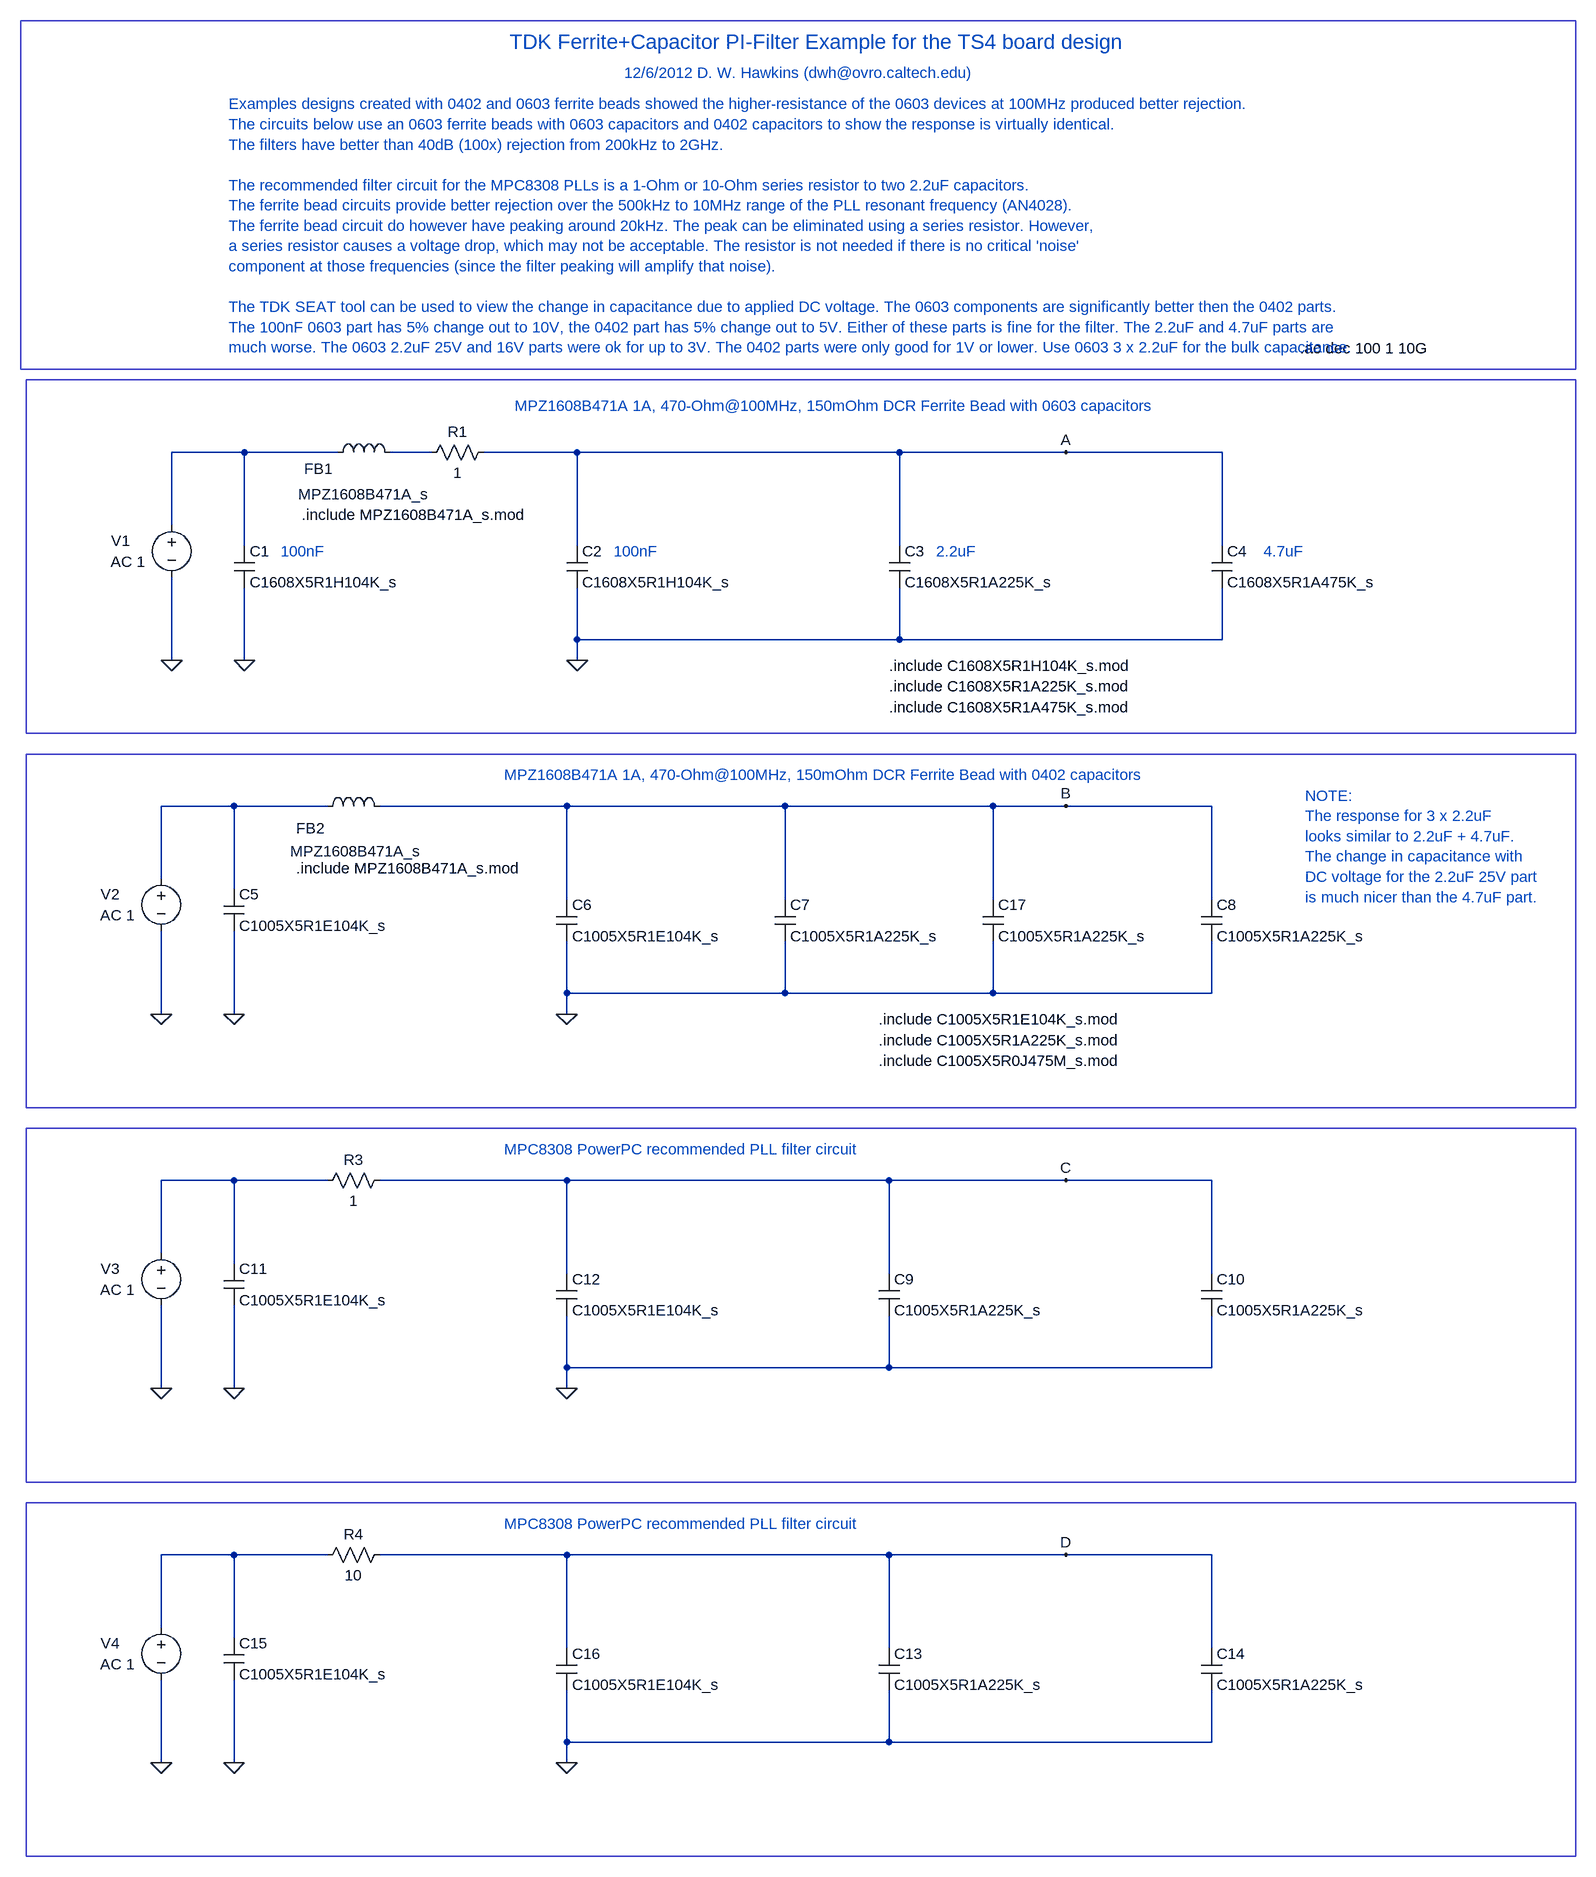
[diagram p0: schematic pi_filter_ts4_board.asc]
pi_filter_ts4_board.asc, the LTspice schematic file:
Version 4
SHEET 1 2924 2692
WIRE 304 -48 192 -48
WIRE 448 -48 304 -48
WIRE 592 -48 528 -48
WIRE 816 -48 672 -48
WIRE 1312 -48 816 -48
WIRE 1568 -48 1312 -48
WIRE 1808 -48 1568 -48
WIRE 192 64 192 -48
WIRE 304 96 304 -48
WIRE 816 96 816 -48
WIRE 1312 96 1312 -48
WIRE 1808 96 1808 -48
WIRE 816 240 816 160
WIRE 1312 240 1312 160
WIRE 1312 240 816 240
WIRE 1808 240 1808 160
WIRE 1808 240 1312 240
WIRE 192 272 192 144
WIRE 304 272 304 160
WIRE 816 272 816 240
WIRE 288 496 176 496
WIRE 432 496 288 496
WIRE 800 496 512 496
WIRE 1136 496 800 496
WIRE 1456 496 1136 496
WIRE 1568 496 1456 496
WIRE 1792 496 1568 496
WIRE 176 608 176 496
WIRE 288 624 288 496
WIRE 800 640 800 496
WIRE 1136 640 1136 496
WIRE 1456 640 1456 496
WIRE 1792 640 1792 496
WIRE 800 784 800 704
WIRE 1136 784 1136 704
WIRE 1136 784 800 784
WIRE 1456 784 1456 704
WIRE 1456 784 1136 784
WIRE 1792 784 1792 704
WIRE 1792 784 1456 784
WIRE 176 816 176 688
WIRE 288 816 288 688
WIRE 800 816 800 784
WIRE 288 1072 176 1072
WIRE 432 1072 288 1072
WIRE 800 1072 512 1072
WIRE 1296 1072 800 1072
WIRE 1568 1072 1296 1072
WIRE 1792 1072 1568 1072
WIRE 176 1184 176 1072
WIRE 288 1200 288 1072
WIRE 800 1216 800 1072
WIRE 1296 1216 1296 1072
WIRE 1792 1216 1792 1072
WIRE 800 1360 800 1280
WIRE 1296 1360 1296 1280
WIRE 1296 1360 800 1360
WIRE 1792 1360 1792 1280
WIRE 1792 1360 1296 1360
WIRE 176 1392 176 1264
WIRE 288 1392 288 1264
WIRE 800 1392 800 1360
WIRE 288 1648 176 1648
WIRE 432 1648 288 1648
WIRE 800 1648 512 1648
WIRE 1296 1648 800 1648
WIRE 1568 1648 1296 1648
WIRE 1792 1648 1568 1648
WIRE 176 1760 176 1648
WIRE 288 1776 288 1648
WIRE 800 1792 800 1648
WIRE 1296 1792 1296 1648
WIRE 1792 1792 1792 1648
WIRE 800 1936 800 1856
WIRE 1296 1936 1296 1856
WIRE 1296 1936 800 1936
WIRE 1792 1936 1792 1856
WIRE 1792 1936 1296 1936
WIRE 176 1968 176 1840
WIRE 288 1968 288 1840
WIRE 800 1968 800 1936
FLAG 192 272 0
FLAG 304 272 0
FLAG 816 272 0
FLAG 176 816 0
FLAG 288 816 0
FLAG 800 816 0
FLAG 1568 -48 A
FLAG 1568 496 B
FLAG 176 1392 0
FLAG 1568 1072 C
FLAG 288 1392 0
FLAG 800 1392 0
FLAG 176 1968 0
FLAG 1568 1648 D
FLAG 288 1968 0
FLAG 800 1968 0
SYMBOL ind 432 -32 R270
WINDOW 0 -25 -14 VTop 2
WINDOW 3 -33 56 VBottom 2
SYMATTR InstName FB1
SYMATTR Value MPZ1608B471A_s
SYMATTR Prefix X
SYMBOL cap 800 96 R0
SYMATTR InstName C2
SYMATTR Value C1608X5R1H104K_s
SYMATTR Prefix X
SYMBOL cap 1296 96 R0
SYMATTR InstName C3
SYMATTR Value C1608X5R1A225K_s
SYMATTR Prefix X
SYMBOL cap 1792 96 R0
SYMATTR InstName C4
SYMATTR Value C1608X5R1A475K_s
SYMATTR Prefix X
SYMBOL cap 288 96 R0
SYMATTR InstName C1
SYMATTR Value C1608X5R1H104K_s
SYMATTR Prefix X
SYMBOL voltage 192 48 R0
WINDOW 0 -93 40 Left 2
WINDOW 123 -94 72 Left 2
WINDOW 39 0 0 Left 2
SYMATTR InstName V1
SYMATTR Value2 AC 1
SYMATTR Value ""
SYMBOL ind 416 512 R270
WINDOW 0 -34 -10 VTop 2
WINDOW 3 -38 60 VBottom 2
SYMATTR InstName FB2
SYMATTR Value MPZ1608B471A_s
SYMATTR Prefix X
SYMBOL cap 784 640 R0
SYMATTR InstName C6
SYMATTR Value C1005X5R1E104K_s
SYMATTR Prefix X
SYMBOL cap 1120 640 R0
SYMATTR InstName C7
SYMATTR Value C1005X5R1A225K_s
SYMATTR Prefix X
SYMBOL cap 1776 640 R0
SYMATTR InstName C8
SYMATTR Value C1005X5R1A225K_s
SYMATTR Prefix X
SYMBOL cap 272 624 R0
SYMATTR InstName C5
SYMATTR Value C1005X5R1E104K_s
SYMATTR Prefix X
SYMBOL voltage 176 592 R0
WINDOW 0 -93 40 Left 2
WINDOW 123 -94 72 Left 2
WINDOW 39 0 0 Left 2
SYMATTR InstName V2
SYMATTR Value2 AC 1
SYMATTR Value ""
SYMBOL cap 1280 1216 R0
SYMATTR InstName C9
SYMATTR Value C1005X5R1A225K_s
SYMATTR Prefix X
SYMBOL cap 1776 1216 R0
SYMATTR InstName C10
SYMATTR Value C1005X5R1A225K_s
SYMATTR Prefix X
SYMBOL voltage 176 1168 R0
WINDOW 0 -93 40 Left 2
WINDOW 123 -94 72 Left 2
WINDOW 39 0 0 Left 2
SYMATTR InstName V3
SYMATTR Value2 AC 1
SYMATTR Value ""
SYMBOL res 416 1088 R270
WINDOW 0 32 56 VTop 2
WINDOW 3 0 56 VBottom 2
SYMATTR InstName R3
SYMATTR Value 1
SYMBOL cap 272 1200 R0
SYMATTR InstName C11
SYMATTR Value C1005X5R1E104K_s
SYMATTR Prefix X
SYMBOL cap 784 1216 R0
SYMATTR InstName C12
SYMATTR Value C1005X5R1E104K_s
SYMATTR Prefix X
SYMBOL cap 1280 1792 R0
SYMATTR InstName C13
SYMATTR Value C1005X5R1A225K_s
SYMATTR Prefix X
SYMBOL cap 1776 1792 R0
SYMATTR InstName C14
SYMATTR Value C1005X5R1A225K_s
SYMATTR Prefix X
SYMBOL voltage 176 1744 R0
WINDOW 0 -93 40 Left 2
WINDOW 123 -94 72 Left 2
WINDOW 39 0 0 Left 2
SYMATTR InstName V4
SYMATTR Value2 AC 1
SYMATTR Value ""
SYMBOL res 416 1664 R270
WINDOW 0 32 56 VTop 2
WINDOW 3 0 56 VBottom 2
SYMATTR InstName R4
SYMATTR Value 10
SYMBOL cap 272 1776 R0
SYMATTR InstName C15
SYMATTR Value C1005X5R1E104K_s
SYMATTR Prefix X
SYMBOL cap 784 1792 R0
SYMATTR InstName C16
SYMATTR Value C1005X5R1E104K_s
SYMATTR Prefix X
SYMBOL res 576 -32 R270
WINDOW 0 32 56 VTop 2
WINDOW 3 0 56 VBottom 2
SYMATTR InstName R1
SYMATTR Value 1
SYMBOL cap 1440 640 R0
SYMATTR InstName C17
SYMATTR Value C1005X5R1A225K_s
SYMATTR Prefix X
TEXT 1928 -208 Left 2 !.ac dec 100 1 10G
TEXT 720 -120 Left 2 ;MPZ1608B471A 1A, 470-Ohm@100MHz, 150mOhm DCR Ferrite Bead with 0603 capacitors
TEXT 704 448 Left 2 ;MPZ1608B471A 1A, 470-Ohm@100MHz, 150mOhm DCR Ferrite Bead with 0402 capacitors
TEXT 712 -680 Left 3 ;TDK Ferrite+Capacitor PI-Filter Example for the TS4 board design
TEXT 888 -632 Left 2 ;12/6/2012 D. W. Hawkins (dwh@ovro.caltech.edu)
TEXT 280 -584 Left 2 ;Examples designs created with 0402 and 0603 ferrite beads showed the higher-resistance of the 0603 devices at 100MHz produced better rejection. \nThe circuits below use an 0603 ferrite beads with 0603 capacitors and 0402 capacitors to show the response is virtually identical.\nThe filters have better than 40dB (100x) rejection from 200kHz to 2GHz.\n \nThe recommended filter circuit for the MPC8308 PLLs is a 1-Ohm or 10-Ohm series resistor to two 2.2uF capacitors.\nThe ferrite bead circuits provide better rejection over the 500kHz to 10MHz range of the PLL resonant frequency (AN4028).\nThe ferrite bead circuit do however have peaking around 20kHz. The peak can be eliminated using a series resistor. However, \na series resistor causes a voltage drop, which may not be acceptable. The resistor is not needed if there is no critical 'noise' \ncomponent at those frequencies (since the filter peaking will amplify that noise).\n \nThe TDK SEAT tool can be used to view the change in capacitance due to applied DC voltage. The 0603 components are significantly better then the 0402 parts.\nThe 100nF 0603 part has 5% change out to 10V, the 0402 part has 5% change out to 5V. Either of these parts is fine for the filter. The 2.2uF and 4.7uF parts are\nmuch worse. The 0603 2.2uF 25V and 16V parts were ok for up to 3V. The 0402 parts were only good for 1V or lower. Use 0603 3 x 2.2uF for the bulk capacitance.
TEXT 1296 344 Left 2 !.include C1608X5R1A475K_s.mod
TEXT 1296 312 Left 2 !.include C1608X5R1A225K_s.mod
TEXT 392 48 Left 2 !.include MPZ1608B471A_s.mod
TEXT 1296 280 Left 2 !.include C1608X5R1H104K_s.mod
TEXT 1368 104 Left 2 ;2.2uF
TEXT 1872 104 Left 2 ;4.7uF
TEXT 872 104 Left 2 ;100nF
TEXT 360 104 Left 2 ;100nF
TEXT 1280 888 Left 2 !.include C1005X5R0J475M_s.mod
TEXT 1280 856 Left 2 !.include C1005X5R1A225K_s.mod
TEXT 1280 824 Left 2 !.include C1005X5R1E104K_s.mod
TEXT 704 1024 Left 2 ;MPC8308 PowerPC recommended PLL filter circuit
TEXT 704 1600 Left 2 ;MPC8308 PowerPC recommended PLL filter circuit
TEXT 384 592 Left 2 !.include MPZ1608B471A_s.mod
TEXT 1936 480 Left 2 ;NOTE: \nThe response for 3 x 2.2uF\nlooks similar to 2.2uF + 4.7uF.\nThe change in capacitance with\nDC voltage for the 2.2uF 25V part\nis much nicer than the 4.7uF part.
RECTANGLE Normal 2352 384 -32 -160
RECTANGLE Normal 2352 -176 -40 -712
RECTANGLE Normal 2352 960 -32 416
RECTANGLE Normal 2352 1536 -32 992
RECTANGLE Normal 2352 2112 -32 1568

The netlist it stands for:
* pi_filter_ts4_board.asc
XFB1 N001 N002 MPZ1608B471A_s  ; pins A B
XC2 A 0 C1608X5R1H104K_s  ; pins A B
XC3 A 0 C1608X5R1A225K_s  ; pins A B
XC4 A 0 C1608X5R1A475K_s  ; pins A B
XC1 N001 0 C1608X5R1H104K_s  ; pins A B
V1 N001 0 AC 1
XFB2 N003 B MPZ1608B471A_s  ; pins A B
XC6 B 0 C1005X5R1E104K_s  ; pins A B
XC7 B 0 C1005X5R1A225K_s  ; pins A B
XC8 B 0 C1005X5R1A225K_s  ; pins A B
XC5 N003 0 C1005X5R1E104K_s  ; pins A B
V2 N003 0 AC 1
XC9 C 0 C1005X5R1A225K_s  ; pins A B
XC10 C 0 C1005X5R1A225K_s  ; pins A B
V3 N004 0 AC 1
R3 N004 C 1
XC11 N004 0 C1005X5R1E104K_s  ; pins A B
XC12 C 0 C1005X5R1E104K_s  ; pins A B
XC13 D 0 C1005X5R1A225K_s  ; pins A B
XC14 D 0 C1005X5R1A225K_s  ; pins A B
V4 N005 0 AC 1
R4 N005 D 10
XC15 N005 0 C1005X5R1E104K_s  ; pins A B
XC16 D 0 C1005X5R1E104K_s  ; pins A B
R1 N002 A 1
XC17 B 0 C1005X5R1A225K_s  ; pins A B
.ac dec 100 1 10G
* MPZ1608B471A 1A, 470-Ohm@100MHz, 150mOhm DCR Ferrite Bead with 0603 capacitors
* MPZ1608B471A 1A, 470-Ohm@100MHz, 150mOhm DCR Ferrite Bead with 0402 capacitors
* TDK Ferrite+Capacitor PI-Filter Example for the TS4 board design
* 12/6/2012 D. W. Hawkins (dwh@ovro.caltech.edu)
* Examples designs created with 0402 and 0603 ferrite beads showed the higher-resistance of the 0603 devices at 100MHz produced better rejection.
* The circuits below use an 0603 ferrite beads with 0603 capacitors and 0402 capacitors to show the response is virtually identical.
* The filters have better than 40dB (100x) rejection from 200kHz to 2GHz.
* The recommended filter circuit for the MPC8308 PLLs is a 1-Ohm or 10-Ohm series resistor to two 2.2uF capacitors.
* The ferrite bead circuits provide better rejection over the 500kHz to 10MHz range of the PLL resonant frequency (AN4028).
* The ferrite bead circuit do however have peaking around 20kHz. The peak can be eliminated using a series resistor. However,
* a series resistor causes a voltage drop, which may not be acceptable. The resistor is not needed if there is no critical 'noise'
* component at those frequencies (since the filter peaking will amplify that noise).
* The TDK SEAT tool can be used to view the change in capacitance due to applied DC voltage. The 0603 components are significantly better then the 0402 parts.
* The 100nF 0603 part has 5% change out to 10V, the 0402 part has 5% change out to 5V. Either of these parts is fine for the filter. The 2.2uF and 4.7uF parts are
* much worse. The 0603 2.2uF 25V and 16V parts were ok for up to 3V. The 0402 parts were only good for 1V or lower. Use 0603 3 x 2.2uF for the bulk capacitance.
.include C1608X5R1A475K_s.mod
.include C1608X5R1A225K_s.mod
.include MPZ1608B471A_s.mod
.include C1608X5R1H104K_s.mod
* 2.2uF
* 4.7uF
* 100nF
* 100nF
.include C1005X5R0J475M_s.mod
.include C1005X5R1A225K_s.mod
.include C1005X5R1E104K_s.mod
* MPC8308 PowerPC recommended PLL filter circuit
* MPC8308 PowerPC recommended PLL filter circuit
.include MPZ1608B471A_s.mod
* NOTE:
* The response for 3 x 2.2uF
* looks similar to 2.2uF + 4.7uF.
* The change in capacitance with
* DC voltage for the 2.2uF 25V part
* is much nicer than the 4.7uF part.
.backanno
.end